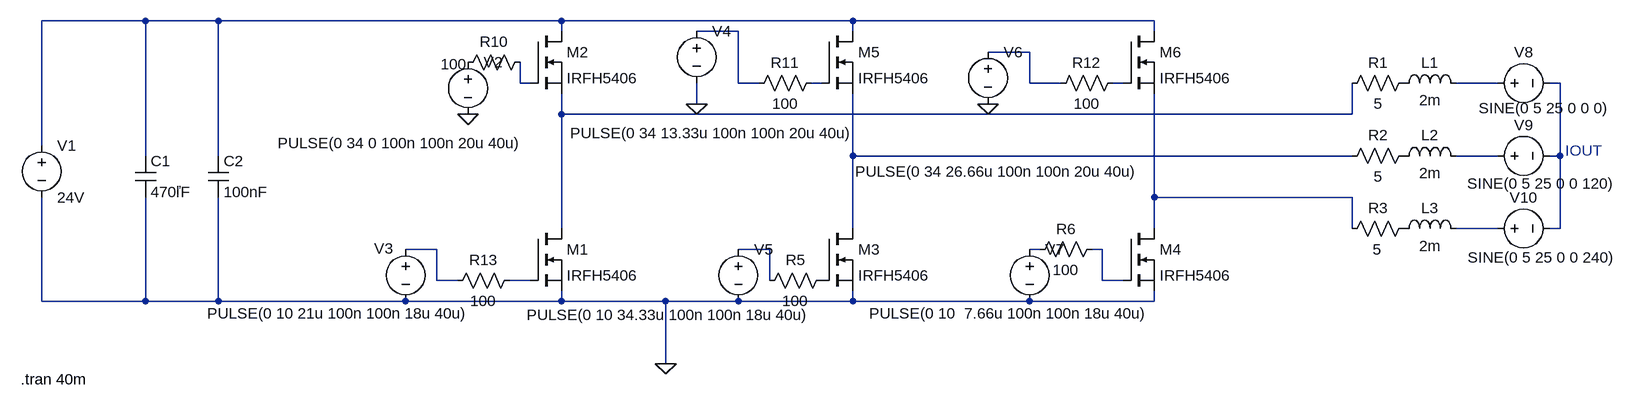
[diagram p0: schematic simülasyon4.asc]
simülasyon4.asc, the LTspice schematic file:
Version 4.1
SHEET 1 2708 1032
WIRE -320 176 -480 176
WIRE -208 176 -320 176
WIRE 320 176 -208 176
WIRE 768 176 320 176
WIRE 1232 176 768 176
WIRE 320 192 320 176
WIRE 592 192 528 192
WIRE 768 192 768 176
WIRE 1232 192 1232 176
WIRE 1040 224 976 224
WIRE 256 272 256 240
WIRE 272 272 256 272
WIRE 592 272 592 192
WIRE 624 272 592 272
WIRE 720 272 704 272
WIRE 1040 272 1040 224
WIRE 1088 272 1040 272
WIRE 1184 272 1168 272
WIRE 1760 272 1696 272
WIRE 1856 272 1840 272
WIRE 528 304 528 272
WIRE 320 320 320 288
WIRE 1536 320 1536 272
WIRE 1536 320 320 320
WIRE -480 368 -480 176
WIRE -320 384 -320 176
WIRE -208 384 -208 176
WIRE 768 384 768 288
WIRE 1536 384 768 384
WIRE 1760 384 1696 384
WIRE 1856 384 1856 272
WIRE 1856 384 1840 384
WIRE 1232 448 1232 288
WIRE 1536 448 1232 448
WIRE 320 496 320 320
WIRE 768 496 768 384
WIRE 1232 496 1232 448
WIRE 1536 496 1536 448
WIRE 1760 496 1696 496
WIRE 1856 496 1856 384
WIRE 1856 496 1840 496
WIRE 128 528 80 528
WIRE 640 528 592 528
WIRE 1056 528 1040 528
WIRE 1152 528 1136 528
WIRE 128 576 128 528
WIRE 160 576 128 576
WIRE 272 576 240 576
WIRE 640 576 640 528
WIRE 1152 576 1152 528
WIRE 1184 576 1152 576
WIRE -480 608 -480 448
WIRE -320 608 -320 448
WIRE -320 608 -480 608
WIRE -208 608 -208 448
WIRE -208 608 -320 608
WIRE 80 608 -208 608
WIRE 320 608 320 592
WIRE 320 608 80 608
WIRE 480 608 320 608
WIRE 592 608 480 608
WIRE 768 608 768 592
WIRE 768 608 592 608
WIRE 1040 608 768 608
WIRE 1232 608 1232 592
WIRE 1232 608 1040 608
WIRE 480 704 480 608
FLAG 480 704 0
FLAG 176 320 0
FLAG 528 304 0
FLAG 976 304 0
SYMBOL voltage -480 352 R0
SYMATTR InstName V1
SYMATTR Value 24V
SYMBOL cap -336 384 R0
SYMATTR InstName C1
SYMATTR Value 470ľF
SYMBOL cap -224 384 R0
SYMATTR InstName C2
SYMATTR Value 100nF
SYMBOL nmos 272 496 R0
SYMATTR InstName M1
SYMATTR Value IRFH5406
SYMBOL nmos 272 192 R0
SYMATTR InstName M2
SYMATTR Value IRFH5406
SYMBOL nmos 720 496 R0
SYMATTR InstName M3
SYMATTR Value IRFH5406
SYMBOL nmos 1184 496 R0
SYMATTR InstName M4
SYMATTR Value IRFH5406
SYMBOL nmos 720 192 R0
SYMATTR InstName M5
SYMATTR Value IRFH5406
SYMBOL nmos 1184 192 R0
SYMATTR InstName M6
SYMATTR Value IRFH5406
SYMBOL res 1632 256 R90
WINDOW 0 0 56 VBottom 2
WINDOW 3 32 56 VTop 2
SYMATTR InstName R1
SYMATTR Value 5
SYMBOL res 1632 368 R90
WINDOW 0 0 56 VBottom 2
WINDOW 3 32 56 VTop 2
SYMATTR InstName R2
SYMATTR Value 5
SYMBOL res 1632 480 R90
WINDOW 0 0 56 VBottom 2
WINDOW 3 33 57 VTop 2
SYMATTR InstName R3
SYMATTR Value 5
SYMBOL ind 1600 288 R270
WINDOW 0 32 56 VTop 2
WINDOW 3 5 56 VBottom 2
SYMATTR InstName L1
SYMATTR Value 2m
SYMATTR SpiceLine Rser=1m
SYMBOL ind 1600 400 R270
WINDOW 0 32 56 VTop 2
WINDOW 3 5 56 VBottom 2
SYMATTR InstName L2
SYMATTR Value 2m
SYMATTR SpiceLine Rser=1m
SYMBOL ind 1600 512 R270
WINDOW 0 32 56 VTop 2
WINDOW 3 5 56 VBottom 2
SYMATTR InstName L3
SYMATTR Value 2m
SYMATTR SpiceLine Rser=1m
SYMBOL voltage 176 224 R0
WINDOW 3 -293 140 Left 2
WINDOW 123 0 0 Left 0
WINDOW 39 0 0 Left 0
SYMATTR Value PULSE(0 34 0 100n 100n 20u 40u)
SYMATTR InstName V2
SYMBOL voltage 80 512 R0
WINDOW 0 -48 15 Left 2
WINDOW 3 -305 115 Left 2
WINDOW 123 0 0 Left 0
WINDOW 39 0 0 Left 0
SYMATTR InstName V3
SYMATTR Value PULSE(0 10 21u 100n 100n 18u 40u)
SYMBOL voltage 528 176 R0
WINDOW 3 -195 173 Left 2
WINDOW 123 0 0 Left 0
WINDOW 39 0 0 Left 0
SYMATTR Value PULSE(0 34 13.33u 100n 100n 20u 40u)
SYMATTR InstName V4
SYMBOL voltage 592 512 R0
WINDOW 3 -326 117 Left 2
WINDOW 123 0 0 Left 0
WINDOW 39 0 0 Left 0
SYMATTR Value PULSE(0 10 34.33u 100n 100n 18u 40u)
SYMATTR InstName V5
SYMBOL voltage 976 208 R0
WINDOW 3 -204 200 Left 2
WINDOW 123 0 0 Left 0
WINDOW 39 0 0 Left 0
SYMATTR Value PULSE(0 34 26.66u 100n 100n 20u 40u)
SYMATTR InstName V6
SYMBOL voltage 1040 512 R0
WINDOW 3 -247 115 Left 2
WINDOW 123 0 0 Left 0
WINDOW 39 0 0 Left 0
SYMATTR Value PULSE(0 10  7.66u 100n 100n 18u 40u)
SYMATTR InstName V7
SYMBOL res 736 560 R90
WINDOW 0 0 56 VBottom 2
WINDOW 3 32 56 VTop 2
SYMATTR InstName R5
SYMATTR Value 100
SYMBOL res 1152 512 R90
WINDOW 0 0 56 VBottom 2
WINDOW 3 32 56 VTop 2
SYMATTR InstName R6
SYMATTR Value 100
SYMBOL res 272 224 R90
WINDOW 0 0 56 VBottom 2
WINDOW 3 3 118 VTop 2
SYMATTR InstName R10
SYMATTR Value 100
SYMBOL res 720 256 R90
WINDOW 0 0 56 VBottom 2
WINDOW 3 32 56 VTop 2
SYMATTR InstName R11
SYMATTR Value 100
SYMBOL res 1184 256 R90
WINDOW 0 0 56 VBottom 2
WINDOW 3 32 56 VTop 2
SYMATTR InstName R12
SYMATTR Value 100
SYMBOL res 256 560 R90
WINDOW 0 0 56 VBottom 2
WINDOW 3 32 56 VTop 2
SYMATTR InstName R13
SYMATTR Value 100
SYMBOL voltage 1744 272 R270
WINDOW 0 32 56 VTop 2
WINDOW 3 -23 87 VBottom 2
WINDOW 123 0 0 Left 0
WINDOW 39 0 0 Left 0
SYMATTR InstName V8
SYMATTR Value SINE(0 5 25 0 0 0)
SYMBOL voltage 1744 384 R270
WINDOW 0 32 56 VTop 2
WINDOW 3 -27 83 VBottom 2
WINDOW 123 0 0 Left 0
WINDOW 39 0 0 Left 0
SYMATTR InstName V9
SYMATTR Value SINE(0 5 25 0 0 120)
SYMBOL voltage 1744 496 R270
WINDOW 0 32 56 VTop 2
WINDOW 3 -29 84 VBottom 2
WINDOW 123 0 0 Left 0
WINDOW 39 0 0 Left 0
SYMATTR InstName V10
SYMATTR Value SINE(0 5 25 0 0 240)
TEXT -512 728 Left 2 !.tran 40m
TEXT 1864 376 Left 2 ;IOUT

The netlist it stands for:
* simülasyon4.asc
V1 N001 0 24V
C1 N001 0 470ľF
C2 N001 0 100nF
M1 N009 N018 0 0 IRFH5406
M2 N001 N004 N009 N009 IRFH5406
M3 N010 P001 0 0 IRFH5406
M4 N012 N017 0 0 IRFH5406
M5 N001 N005 N010 N010 IRFH5406
M6 N001 N006 N012 N012 IRFH5406
R1 P002 N009 5
R2 P003 N010 5
R3 P004 N012 5
L1 P002 N007 2m Rser=1m
L2 P003 N011 2m Rser=1m
L3 P004 N013 2m Rser=1m
V2 P005 0 PULSE(0 34 0 100n 100n 20u 40u)
V3 N014 0 PULSE(0 10 21u 100n 100n 18u 40u)
V4 N002 0 PULSE(0 34 13.33u 100n 100n 20u 40u)
V5 N015 0 PULSE(0 10 34.33u 100n 100n 18u 40u)
V6 N003 0 PULSE(0 34 26.66u 100n 100n 20u 40u)
V7 N016 0 PULSE(0 10  7.66u 100n 100n 18u 40u)
R5 P001 N015 100
R6 N017 N016 100
R10 N004 P005 100
R11 N005 N002 100
R12 N006 N003 100
R13 N018 N014 100
V8 N007 N008 SINE(0 5 25 0 0 0)
V9 N011 N008 SINE(0 5 25 0 0 120)
V10 N013 N008 SINE(0 5 25 0 0 240)
.model NMOS NMOS
.model PMOS PMOS
.lib standard.mos
.tran 40m
* IOUT
.backanno
.end